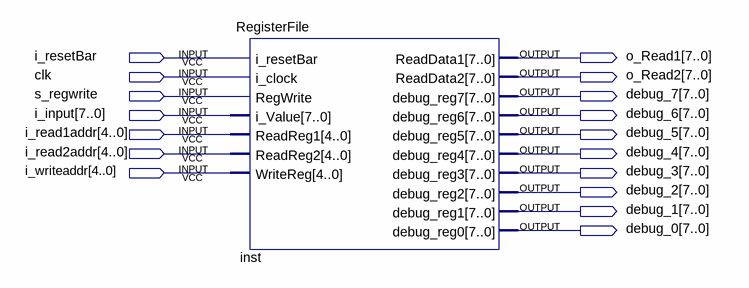
[diagram p0: schematic sheet]
// Quartus schematic RegsiterFIleTest.bdf as structural Verilog: 1 symbols, 17 pins
module RegsiterFIleTest (
  input  i_resetBar,
  input  clk,
  input  s_regwrite,
  input  [7:0] i_input,
  input  [4:0] i_read1addr,
  input  [4:0] i_read2addr,
  input  [4:0] i_writeaddr,
  output [7:0] o_Read1,
  output [7:0] o_Read2,
  output [7:0] debug_7,
  output [7:0] debug_6,
  output [7:0] debug_5,
  output [7:0] debug_4,
  output [7:0] debug_3,
  output [7:0] debug_2,
  output [7:0] debug_1,
  output [7:0] debug_0
);

  RegisterFile inst (
    .i_resetBar(i_resetBar), .i_clock(clk), .RegWrite(s_regwrite), .i_Value(i_input), .ReadReg1(i_read1addr),
    .ReadReg2(i_read2addr), .WriteReg(i_writeaddr), .ReadData1(o_Read1), .ReadData2(o_Read2),
    .debug_reg7(debug_7), .debug_reg6(debug_6), .debug_reg5(debug_5), .debug_reg4(debug_4),
    .debug_reg3(debug_3), .debug_reg2(debug_2), .debug_reg1(debug_1), .debug_reg0(debug_0));
endmodule
